# EAGLE board motordriver_4ch (EAGLE 6.5.0)
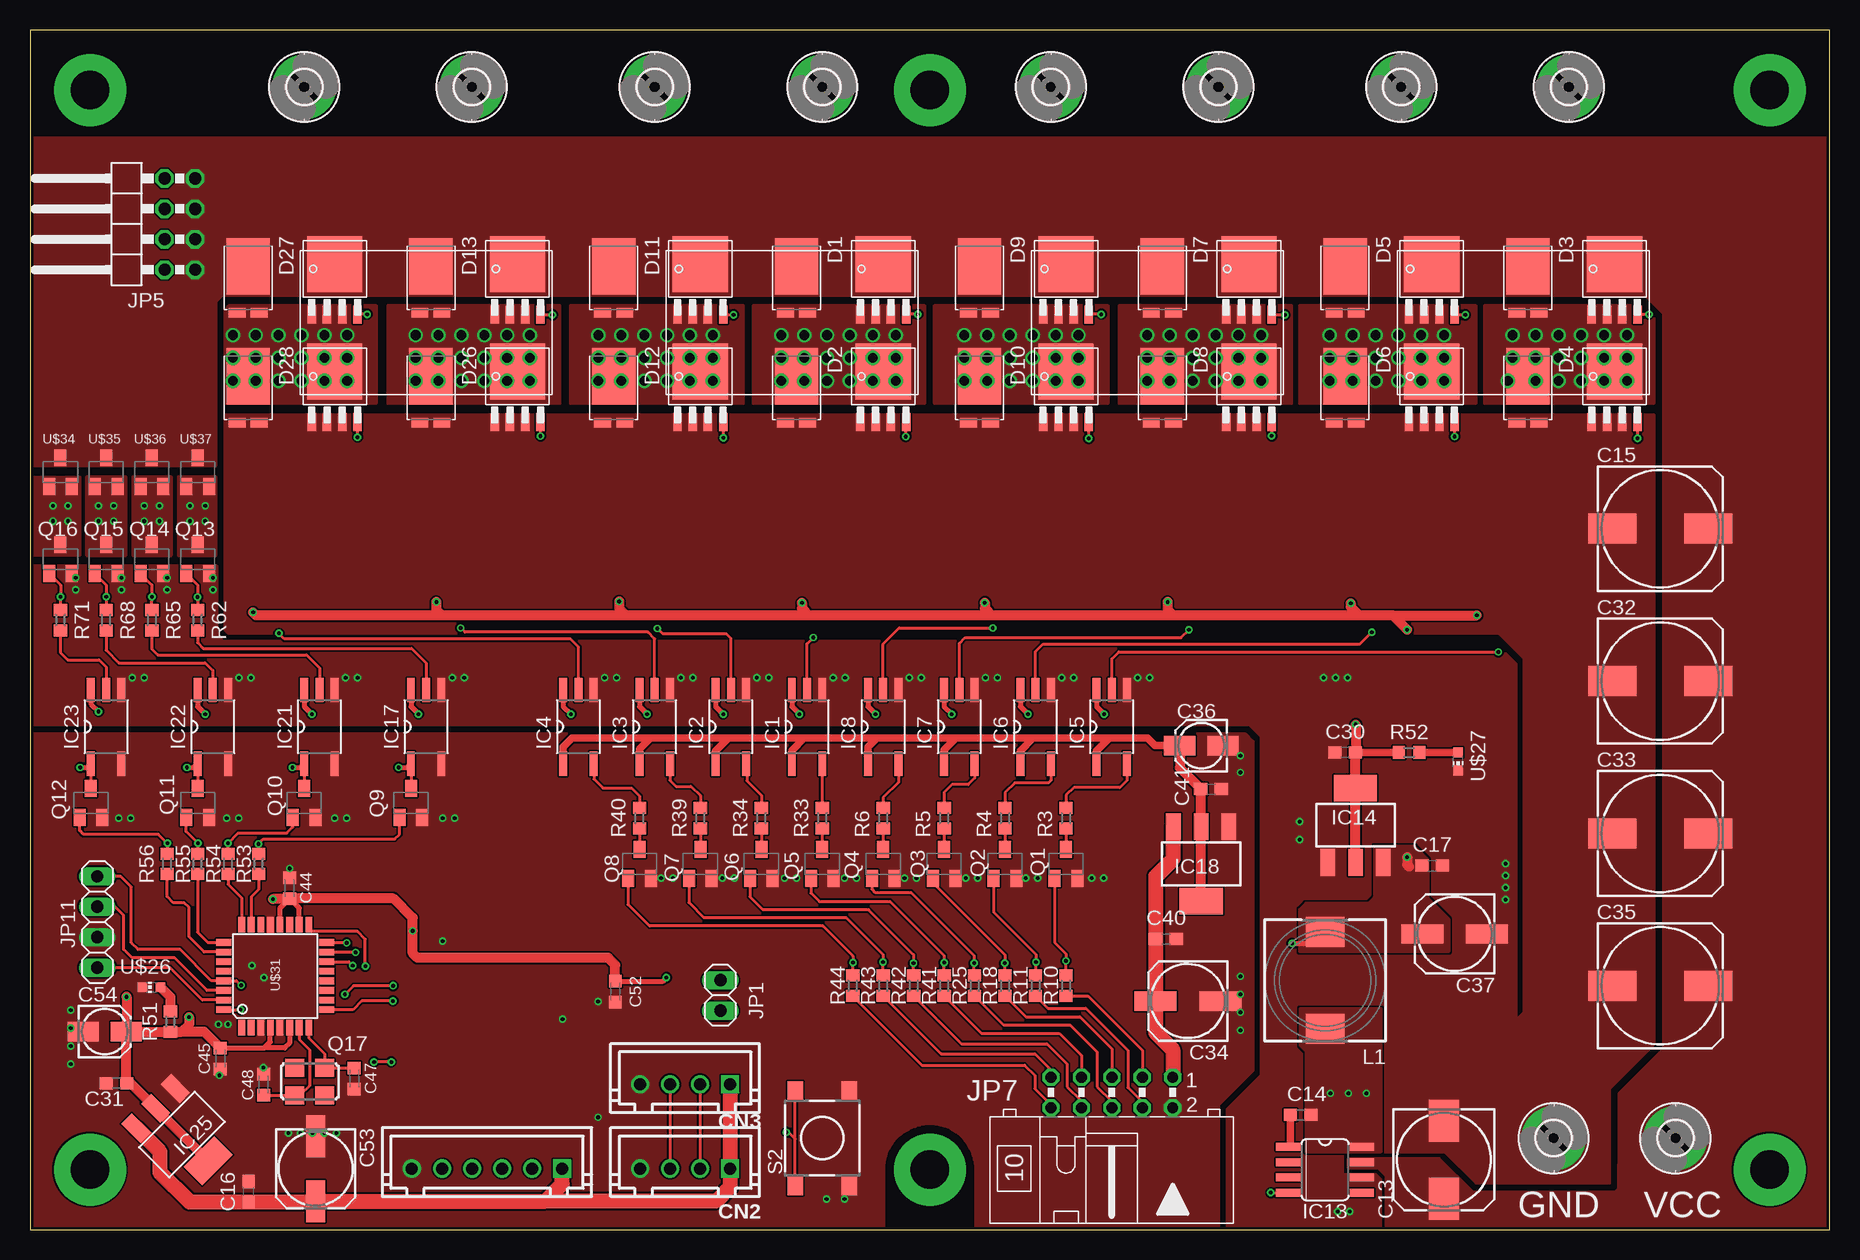
[diagram p1: board, top side]
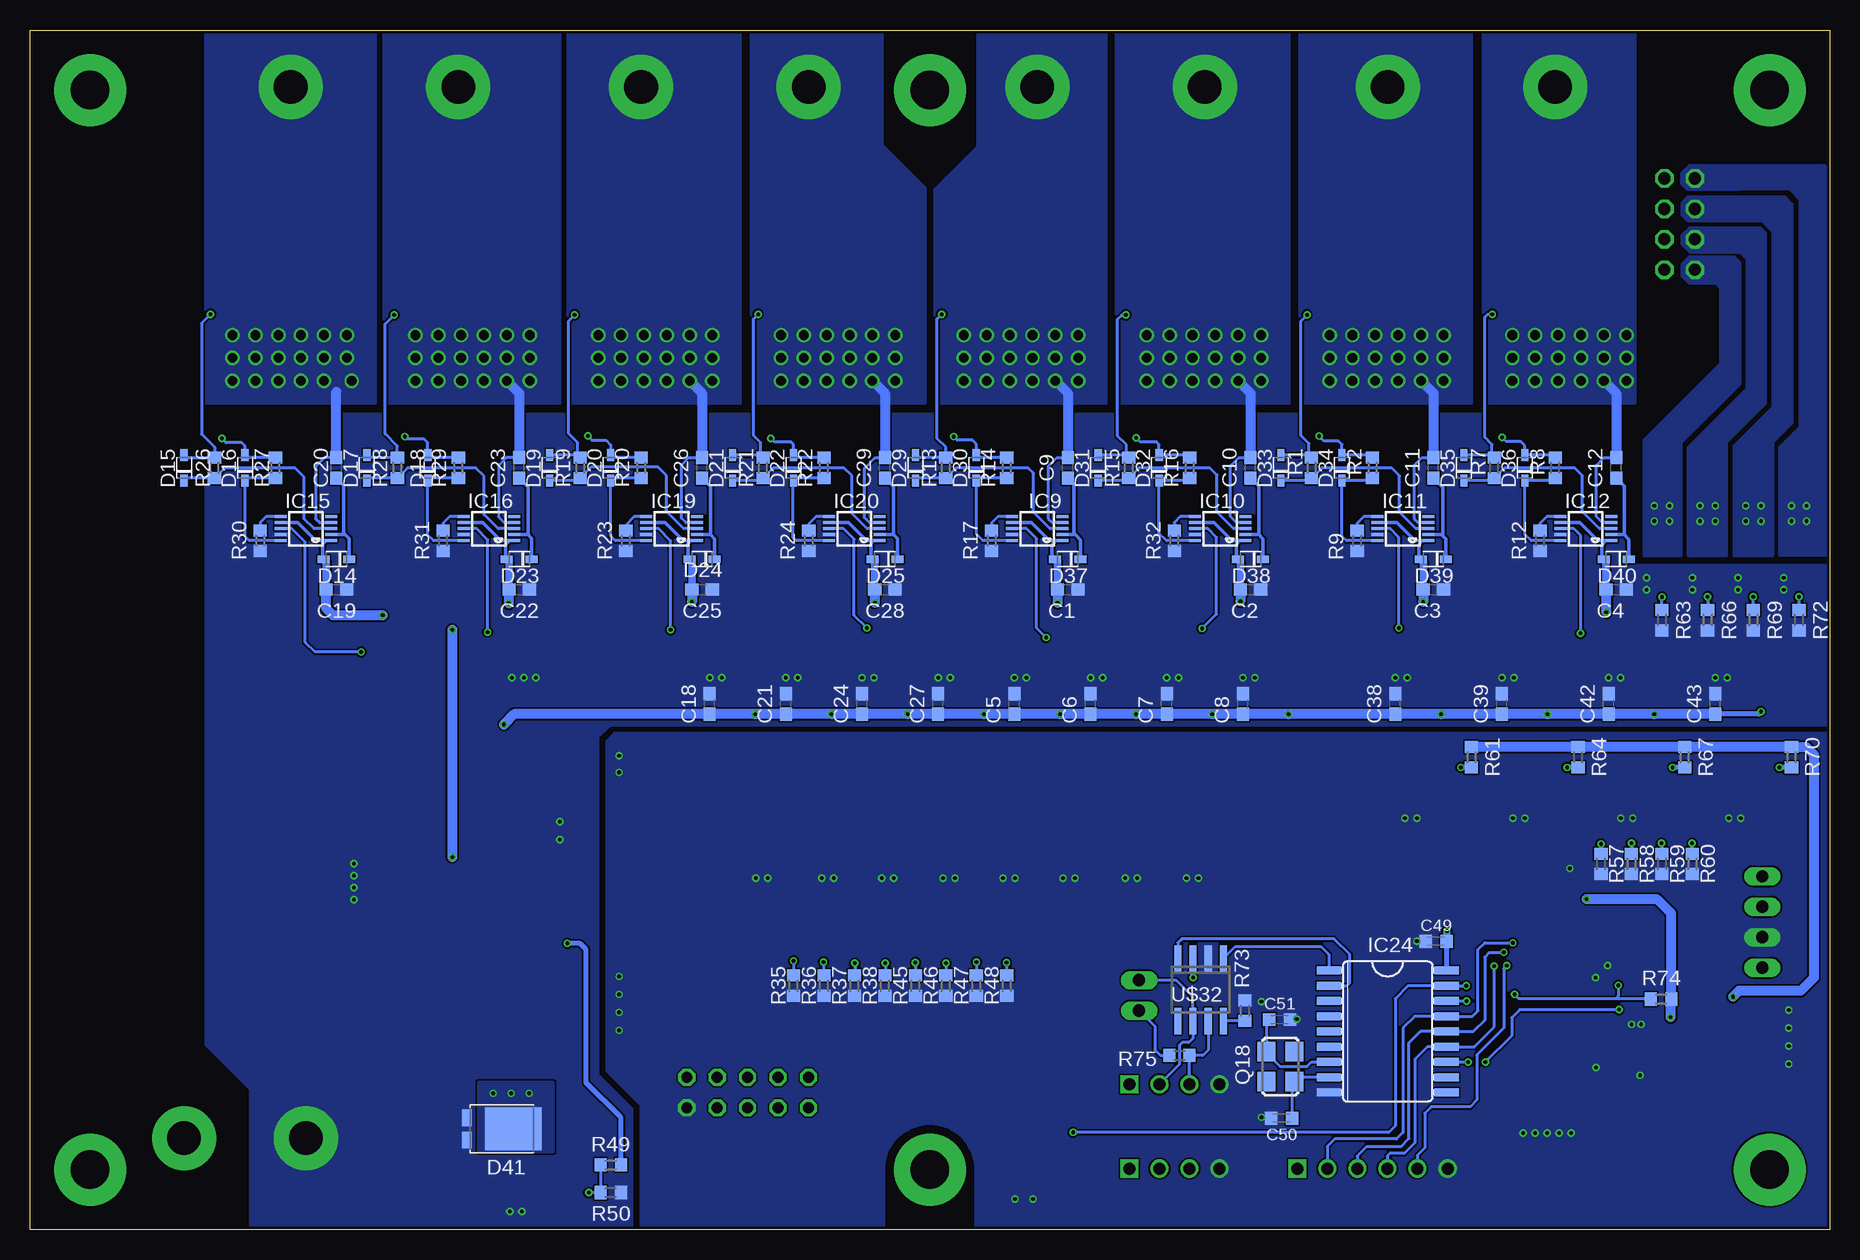
[diagram p2: board, bottom side, seen from below]

Size 150 x 100 mm. Coordinates in mm from the lower left corner, seen from the top.
Outline: 0,0 150,0 150,100 0,100 0,0
Copper layers (1*16): Top 0.035mm / dielectric 1.5mm / Bottom 0.035mm
Design rules "Elecrow_2-layer_eagle_rule": minimum track width 6mil, minimum drill 12mil, track to track 6mil, track to pad 6mil, pad to pad 6mil, via to via 6mil, smd to smd 0mil, copper to edge 10mil, drill to drill 10mil, minimum pad ring 10mil, minimum via ring 6mil, stop-mask expansion 2mil, vias tented up to drill 100mil, thermal gap 10mil
tRestrict: 14 lines
bRestrict: 14 lines

## Footprints (pad centres in the part's own frame; a part is rotated, then mirrored left to right if it is on the bottom)
C0603 = smd 1.1 x 1: 1 -0.85,0; 2 0.85,0
153CLV-0810 = smd 3.5 x 2.5: + 3.25,0; - -3.25,0
153CLV-1010 = smd 4 x 2.5: + 4,0; - -4,0
153CLV-0605 = smd 3.5 x 1.6: + 2.7,0; - -2.7,0
153CLV-0405 = smd 2.6 x 1.6: + 1.8,0; - -1.8,0
C0603K = smd 1.05 x 1.08: 1 -0.875,0; 2 0.875,0
JST-B4B-XH-A = drill 1 square: 1 -3.75,0 | drill 1: 2 -1.25,0; 3 1.25,0; 4 3.75,0
POWER_DI_5 = smd 0.8 x 1.4: A1 3.87,0.92; A2 3.87,-0.92 | smd 4.7 x 3.6: K 0,0
USC(1.25X2.5) = smd 1 x 0.6: A -1.05,0; K 1.05,0
MFSOP6 = smd 0.66 x 2.032: 1 -1.27,-3.073; 3 1.27,-3.073; 4 1.27,3.073; 5 0,3.073; 6 -1.27,3.073
MSOP10 = smd 0.25 x 1: 1 -1,-2.113; 2 -0.5,-2.113; 3 0,-2.113; 4 0.5,-2.113; 5 1,-2.113; 6 1,2.113; 7 0.5,2.113; 8 0,2.113; 9 -0.5,2.113; 10 -1,2.113
SOP8-150 = smd 0.66 x 2.032: 1 -1.27,-3.073; 2 0,-3.073; 3 1.27,-3.073; 4 2.54,-3.073; 5 2.54,3.073; 6 1.27,3.073; 7 0,3.073; 8 -1.27,3.073
SOT223 = smd 1.219 x 2.235: 1 -2.311,-3.099; 2 0,-3.099; 3 2.311,-3.099 | smd 3.6 x 2.2: 4 0,3.099
SO18L = smd 0.66 x 2.032: 1 -5.08,-4.902; 2 -3.81,-4.902; 3 -2.54,-4.902; 4 -1.27,-4.902; 5 0,-4.902; 6 1.27,-4.902; 7 2.54,-4.902; 8 3.81,-4.902; 9 5.08,-4.902; 10 5.08,4.902; 11 3.81,4.902; 12 2.54,4.902; 13 1.27,4.902; 14 0,4.902; 15 -1.27,4.902; 16 -2.54,4.902; 17 -3.81,4.902; 18 -5.08,4.902
1X02 = drill 1.016 long: 1 -1.27,0; 2 1.27,0
2X04/90 = drill 1.016 octagon: 1 -3.81,-6.35; 2 -3.81,-3.81; 3 -1.27,-6.35; 4 -1.27,-3.81; 5 1.27,-6.35; 6 1.27,-3.81; 7 3.81,-6.35; 8 3.81,-3.81
ML10L = drill 0.914 octagon: 1 -5.08,-1.27; 2 -5.08,1.27; 3 -2.54,-1.27; 4 -2.54,1.27; 5 0,-1.27; 6 0,1.27; 7 2.54,-1.27; 8 2.54,1.27; 9 5.08,-1.27; 10 5.08,1.27
1X04 = drill 1.016 long: 1 -3.81,0; 2 -1.27,0; 3 1.27,0; 4 3.81,0
SLF10145 = smd 3.2 x 2.5: P$1 0,4.05; P$2 0,-4.05
SC-59(TYPE1) = smd 1 x 1.4: B -0.95,-1.2; C 0,1.2; E 0.95,-1.2
ASF = smd 1.6 x 1.5: 1 -1.25,-1.15; 2 1.25,-1.15; 3 1.25,1.15; 4 -1.25,1.15
R0603 = smd 1 x 1.1: 1 -0.85,0; 2 0.85,0
DTSM-6 = smd 1.55 x 1.3: 1 -3.975,2.25; 2 3.975,2.25; 3 -3.975,-2.25; 4 3.975,-2.25
2,8-PAD = drill 2.8 pad 5.334: B2,8 0,0
LFPAK56 = smd 0.7 x 1.5: 1 -1.905,-3.8; 2 -0.635,-3.8; 3 0.635,-3.8; 4 1.905,-3.8 | smd 4.6 x 4.7: 5 0,0.4
0603 = smd 0.8 x 0.8: A 0,-0.75; C 0,0.75
JST-B6B-XH-A = drill 1 square: 1 0.08,0 | drill 1: 2 2.58,0; 3 5.08,0; 4 7.58,0; 5 10.08,0; 6 12.62,0
TQFP = smd 1.27 x 0.559: 1 -4.293,2.8; 2 -4.293,2; 3 -4.293,1.2; 4 -4.293,0.4; 5 -4.293,-0.4; 6 -4.293,-1.2; 7 -4.293,-2; 8 -4.293,-2.8; 17 4.293,-2.8; 18 4.293,-2; 19 4.293,-1.2; 20 4.293,-0.4; 21 4.293,0.4; 22 4.293,1.2; 23 4.293,2; 24 4.293,2.8 | smd 0.559 x 1.27: 9 -2.8,-4.293; 10 -2,-4.293; 11 -1.2,-4.293; 12 -0.4,-4.293; 13 0.4,-4.293; 14 1.2,-4.293; 15 2,-4.293; 16 2.8,-4.293; 25 2.8,4.293; 26 2,4.293; 27 1.2,4.293; 28 0.4,4.293; 29 -0.4,4.293; 30 -1.2,4.293; 31 -2,4.293; 32 -2.8,4.293
SOIC = smd 0.6 x 2.2: 1 -1.905,-2.6; 2 -0.635,-2.6; 3 0.635,-2.6; 4 1.905,-2.6; 5 1.905,2.6; 6 0.635,2.6; 7 -0.635,2.6; 8 -1.905,2.6
SC-59 = smd 1 x 1.4: A@1 -0.95,-1.2; A@2 0.95,-1.2; K 0,1.2

## Placement (x,y rotation side)
C1  50V,0.1u  [C0603]  63.5,53.34 0 bottom
C2  50V,0.1u  [C0603]  48.26,53.34 0 bottom
C3  50V,0.1u  [C0603]  33.02,53.34 0 bottom
C4  50V,0.1u  [C0603]  17.78,53.34 0 bottom
C5  50V,0.1u  [C0603]  67.94,43.81 90 bottom
C6  50V,0.1u  [C0603]  61.59,43.81 90 bottom
C7  50V,0.1u  [C0603]  55.24,43.81 90 bottom
C8  50V,0.1u  [C0603]  48.9,43.81 90 bottom
C9  50v,1u  [C0603]  63.5,63.5 90 bottom
C10  50v,1u  [C0603]  48.26,63.5 90 bottom
C11  50v,1u  [C0603]  33.02,63.5 90 bottom
C12  50v,1u  [C0603]  17.78,63.5 90 bottom
C13  35v,220u  [153CLV-0810]  117.86,5.82 270 top
C14  0.01u,50v  [C0603]  105.91,9.55 0 top
C15  35v,330u  [153CLV-1010]  135.89,58.42 0 top
C16  50V,0.1u  [C0603]  18.24,3.15 90 top
C17  50V,0.1u  [C0603]  116.88,30.34 0 top
C18  50V,0.1u  [C0603]  93.34,43.81 90 bottom
C19  50V,0.1u  [C0603]  124.46,53.34 0 bottom
C20  50v,1u  [C0603]  124.46,63.5 90 bottom
C21  50V,0.1u  [C0603]  87,43.81 90 bottom
C22  50V,0.1u  [C0603]  109.22,53.34 0 bottom
C23  50v,1u  [C0603]  109.22,63.5 90 bottom
C24  50V,0.1u  [C0603]  80.64,43.81 90 bottom
C25  50V,0.1u  [C0603]  93.98,53.34 0 bottom
C26  50v,1u  [C0603]  93.98,63.5 90 bottom
C27  50V,0.1u  [C0603]  74.3,43.81 90 bottom
C28  50V,0.1u  [C0603]  78.74,53.34 0 bottom
C29  50v,1u  [C0603]  78.74,63.5 90 bottom
C30  50V,0.1u  [C0603]  109.63,39.78 180 top
C31  50V,0.1u  [C0603]  7.2,12.19 180 top
C32  35v,330u  [153CLV-1010]  135.89,45.72 0 top
C33  35v,330u  [153CLV-1010]  135.89,33.02 0 top
C34  16v,100u  [153CLV-0605]  96.52,19.05 180 top
C35  35v,330u  [153CLV-1010]  135.89,20.32 0 top
C36  47uF  [153CLV-0405]  97.64,40.34 180 top
C37  16v,100u  [153CLV-0605]  118.75,24.65 180 top
C38  0.1u  [C0603]  36.2,43.81 90 bottom
C39  0.1u  [C0603]  27.3,43.81 90 bottom
C40  50V,0.1u  [C0603]  94.69,24.23 0 top
C41  50V,0.1u  [C0603]  98.44,36.73 0 top
C42  0.1u  [C0603]  18.41,43.81 90 bottom
C43  0.1u  [C0603]  9.53,43.81 90 bottom
C44  0.1u  [C0603K]  21.64,28.47 90 top
C45  0.1u  [C0603K]  15.86,14.26 270 top
C47  22p  [C0603K]  27.03,12.59 90 top
C48  22p  [C0603K]  19.47,12.07 270 top
C49  0.1u  [C0603K]  32.79,24.03 180 bottom
C50  10p  [C0603K]  45.67,9.28 0 bottom
C51  10p  [C0603K]  45.82,17.5 180 bottom
C52  0.1u  [C0603K]  48.79,19.83 270 top
C53  16v,100u  [153CLV-0605]  23.81,5.07 270 top
C54  47uF  [153CLV-0405]  6.23,16.5 0 top
CN2  CN4-JST-XH-TOP  [JST-B4B-XH-A]  54.61,5.08 180 top
CN3  CN4-JST-XH-TOP  [JST-B4B-XH-A]  54.61,12.1 180 top
D1  PDS540  [POWER_DI_5]  63.9,80.28 270 top
D2  PDS540  [POWER_DI_5]  63.9,71.12 270 top
D3  PDS540  [POWER_DI_5]  124.86,80.28 270 top
D4  PDS540  [POWER_DI_5]  124.86,71.12 270 top
D5  PDS540  [POWER_DI_5]  109.62,80.28 270 top
D6  PDS540  [POWER_DI_5]  109.62,71.12 270 top
D7  PDS540  [POWER_DI_5]  94.38,80.28 270 top
D8  PDS540  [POWER_DI_5]  94.38,71.12 270 top
D9  PDS540  [POWER_DI_5]  79.14,80.28 270 top
D10  PDS540  [POWER_DI_5]  79.14,71.12 270 top
D11  PDS540  [POWER_DI_5]  48.66,80.28 270 top
D12  PDS540  [POWER_DI_5]  48.66,71.12 270 top
D13  PDS540  [POWER_DI_5]  33.42,80.28 270 top
D14  1SS404  [USC(1.25X2.5)]  124.46,55.88 0 bottom
D15  1SS404  [USC(1.25X2.5)]  137.16,63.5 270 bottom
D16  1SS404  [USC(1.25X2.5)]  132.08,63.5 270 bottom
D17  1SS404  [USC(1.25X2.5)]  121.92,63.5 270 bottom
D18  1SS404  [USC(1.25X2.5)]  116.84,63.5 270 bottom
D19  1SS404  [USC(1.25X2.5)]  106.68,63.5 270 bottom
D20  1SS404  [USC(1.25X2.5)]  101.6,63.5 270 bottom
D21  1SS404  [USC(1.25X2.5)]  91.44,63.5 270 bottom
D22  1SS404  [USC(1.25X2.5)]  86.36,63.5 270 bottom
D23  1SS404  [USC(1.25X2.5)]  109.22,55.88 0 bottom
D24  1SS404  [USC(1.25X2.5)]  93.98,55.88 0 bottom
D25  1SS404  [USC(1.25X2.5)]  78.74,55.88 0 bottom
D26  PDS540  [POWER_DI_5]  33.42,71.12 270 top
D27  PDS540  [POWER_DI_5]  18.18,80.28 270 top
D28  PDS540  [POWER_DI_5]  18.18,71.12 270 top
D29  1SS404  [USC(1.25X2.5)]  76.2,63.5 270 bottom
D30  1SS404  [USC(1.25X2.5)]  71.12,63.5 270 bottom
D31  1SS404  [USC(1.25X2.5)]  60.96,63.5 270 bottom
D32  1SS404  [USC(1.25X2.5)]  55.88,63.5 270 bottom
D33  1SS404  [USC(1.25X2.5)]  45.72,63.5 270 bottom
D34  1SS404  [USC(1.25X2.5)]  40.64,63.5 270 bottom
D35  1SS404  [USC(1.25X2.5)]  30.48,63.5 270 bottom
D36  1SS404  [USC(1.25X2.5)]  25.4,63.5 270 bottom
D37  1SS404  [USC(1.25X2.5)]  63.5,55.88 0 bottom
D38  1SS404  [USC(1.25X2.5)]  48.26,55.88 0 bottom
D39  1SS404  [USC(1.25X2.5)]  33.02,55.88 0 bottom
D40  1SS404  [USC(1.25X2.5)]  17.78,55.88 0 bottom
D41  PDS540  [POWER_DI_5]  109.72,8.38 180 bottom
IC1  TLP117  [MFSOP6]  64.77,41.91 0 top
IC2  TLP117  [MFSOP6]  58.42,41.91 0 top
IC3  TLP117  [MFSOP6]  52.07,41.91 0 top
IC4  TLP117  [MFSOP6]  45.72,41.91 0 top
IC5  TLP117  [MFSOP6]  90.17,41.91 0 top
IC6  TLP117  [MFSOP6]  83.82,41.91 0 top
IC7  TLP117  [MFSOP6]  77.47,41.91 0 top
IC8  TLP117  [MFSOP6]  71.12,41.91 0 top
IC9  LM5106  [MSOP10]  66.04,58.42 90 bottom
IC10  LM5106  [MSOP10]  50.8,58.42 90 bottom
IC11  LM5106  [MSOP10]  35.56,58.42 90 bottom
IC12  LM5106  [MSOP10]  20.32,58.42 90 bottom
IC13  LM2675-ADJ  [SOP8-150]  107.95,5.62 270 top
IC14  LM1117MPX-5.0  [SOT223]  110.49,33.7 0 top
IC15  LM5106  [MSOP10]  127,58.42 90 bottom
IC16  LM5106  [MSOP10]  111.76,58.42 90 bottom
IC17  TLP117  [MFSOP6]  33.02,41.91 0 top
IC18  LM1117MPX-5.0  [SOT223]  97.62,30.48 180 top
IC19  LM5106  [MSOP10]  96.52,58.42 90 bottom
IC20  LM5106  [MSOP10]  81.28,58.42 90 bottom
IC21  TLP117  [MFSOP6]  24.13,41.91 0 top
IC22  TLP117  [MFSOP6]  15.24,41.91 0 top
IC23  TLP117  [MFSOP6]  6.35,41.91 0 top
IC24  MCP2515-E/SO  [SO18L]  36.83,16.51 270 bottom
IC25  LM1117MPX-5.0  [SOT223]  12.67,7.91 225 top
JP1  [1X02]  57.55,19.52 270 top
JP5  [2X04/90]  7.41,83.82 90 top
JP7  MOTOR  [ML10L]  90.17,11.43 180 top
JP11  [1X04]  5.61,25.64 90 top
L1  68u,1.2A  [SLF10145]  107.95,20.77 180 top
Q1  2SC2712  [SC-59(TYPE1)]  86.36,30.48 0 top
Q2  2SC2712  [SC-59(TYPE1)]  81.28,30.48 0 top
Q3  2SC2712  [SC-59(TYPE1)]  76.2,30.48 0 top
Q4  2SC2712  [SC-59(TYPE1)]  71.12,30.48 0 top
Q5  2SC2712  [SC-59(TYPE1)]  66.04,30.48 0 top
Q6  2SC2712  [SC-59(TYPE1)]  60.96,30.48 0 top
Q7  2SC2712  [SC-59(TYPE1)]  55.88,30.48 0 top
Q8  2SC2712  [SC-59(TYPE1)]  50.8,30.48 0 top
Q9  2SC2712  [SC-59(TYPE1)]  31.75,35.56 0 top
Q10  2SC2712  [SC-59(TYPE1)]  22.86,35.56 0 top
Q11  2SC2712  [SC-59(TYPE1)]  13.97,35.56 0 top
Q12  2SC2712  [SC-59(TYPE1)]  5.08,35.56 0 top
Q13  2SC2712  [SC-59(TYPE1)]  13.97,55.88 0 top
Q14  2SC2712  [SC-59(TYPE1)]  10.16,55.88 0 top
Q15  2SC2712  [SC-59(TYPE1)]  6.35,55.88 0 top
Q16  2SC2712  [SC-59(TYPE1)]  2.54,55.88 0 top
Q17  ASF1  [ASF]  23.32,12.34 0 top
Q18  ASF1  [ASF]  45.77,13.59 90 bottom
R1  47  [R0603]  43.18,63.5 90 bottom
R2  47  [R0603]  38.1,63.5 90 bottom
R3  300  [R0603]  86.36,34.29 90 top
R4  300  [R0603]  81.28,34.29 90 top
R5  300  [R0603]  76.2,34.29 90 top
R6  300  [R0603]  71.12,34.29 90 top
R7  47  [R0603]  27.94,63.5 90 bottom
R8  47  [R0603]  22.86,63.5 90 bottom
R9  51k  [R0603]  39.37,57.42 90 bottom
R10  10k  [R0603]  86.36,20.32 90 top
R11  10k  [R0603]  83.82,20.32 90 top
R12  51k  [R0603]  24.13,57.42 90 bottom
R13  47  [R0603]  73.66,63.5 90 bottom
R14  47  [R0603]  68.58,63.5 90 bottom
R15  47  [R0603]  58.42,63.5 90 bottom
R16  47  [R0603]  53.34,63.5 90 bottom
R17  51k  [R0603]  69.85,57.42 90 bottom
R18  10k  [R0603]  81.28,20.32 90 top
R19  47  [R0603]  104.14,63.5 90 bottom
R20  47  [R0603]  99.06,63.5 90 bottom
R21  47  [R0603]  88.9,63.5 90 bottom
R22  47  [R0603]  83.82,63.5 90 bottom
R23  51k  [R0603]  100.33,57.42 90 bottom
R24  51k  [R0603]  85.09,57.42 90 bottom
R25  10k  [R0603]  78.74,20.32 90 top
R26  47  [R0603]  134.62,63.5 90 bottom
R27  47  [R0603]  129.54,63.5 90 bottom
R28  47  [R0603]  119.38,63.5 90 bottom
R29  47  [R0603]  114.3,63.5 90 bottom
R30  51k  [R0603]  130.81,57.42 90 bottom
R31  51k  [R0603]  115.57,57.42 90 bottom
R32  51k  [R0603]  54.61,57.42 90 bottom
R33  300  [R0603]  66.04,34.29 90 top
R34  300  [R0603]  60.96,34.29 90 top
R35  10k  [R0603]  86.36,20.32 90 bottom
R36  10k  [R0603]  83.82,20.32 90 bottom
R37  10k  [R0603]  81.28,20.32 90 bottom
R38  10k  [R0603]  78.74,20.32 90 bottom
R39  300  [R0603]  55.88,34.29 90 top
R40  300  [R0603]  50.8,34.29 90 top
R41  10k  [R0603]  76.2,20.32 90 top
R42  10k  [R0603]  73.66,20.32 90 top
R43  10k  [R0603]  71.12,20.32 90 top
R44  10k  [R0603]  68.58,20.32 90 top
R45  10k  [R0603]  76.2,20.32 90 bottom
R46  10k  [R0603]  73.66,20.32 90 bottom
R47  10k  [R0603]  71.12,20.32 90 bottom
R48  10k  [R0603]  68.58,20.32 90 bottom
R49  10k  [R0603]  101.6,5.39 180 bottom
R50  1.5k  [R0603]  101.6,3.08 0 bottom
R51  1k  [R0603]  11.7,17.33 270 top
R52  1k  [R0603]  114.96,39.77 180 top
R53  10k  [R0603]  19.05,30.48 270 top
R54  10k  [R0603]  16.51,30.48 270 top
R55  10k  [R0603]  13.97,30.48 270 top
R56  10k  [R0603]  11.43,30.48 270 top
R57  10k  [R0603]  19.05,30.48 270 bottom
R58  10k  [R0603]  16.51,30.48 270 bottom
R59  10k  [R0603]  13.97,30.48 270 bottom
R60  10k  [R0603]  11.43,30.48 270 bottom
R61  300  [R0603]  29.84,39.37 90 bottom
R62  1k  [R0603]  13.97,50.8 270 top
R63  10k  [R0603]  13.97,50.8 270 bottom
R64  300  [R0603]  20.95,39.37 90 bottom
R65  1k  [R0603]  10.16,50.8 270 top
R66  10k  [R0603]  10.16,50.8 270 bottom
R67  300  [R0603]  12.06,39.37 90 bottom
R68  1k  [R0603]  6.35,50.8 270 top
R69  10k  [R0603]  6.35,50.8 270 bottom
R70  300  [R0603]  3.17,39.37 90 bottom
R71  1k  [R0603]  2.54,50.8 270 top
R72  10k  [R0603]  2.54,50.8 270 bottom
R73  10k  [R0603]  48.73,18.25 90 bottom
R74  10k  [R0603]  14.04,19.21 0 bottom
R75  120  [R0603]  54.19,14.51 180 bottom
S2  DTSM-6  [DTSM-6]  66.04,7.62 90 top
U$1  MOUNT-PAD-ROUND2.8  [2,8-PAD]  66.04,95.25 0 top
U$2  MOUNT-PAD-ROUND2.8  [2,8-PAD]  52.07,95.25 0 top
U$3  MOUNT-PAD-ROUND2.8  [2,8-PAD]  36.83,95.25 0 top
U$4  MOUNT-PAD-ROUND2.8  [2,8-PAD]  22.86,95.25 0 top
U$5  PSMN1R0-40YLD  [LFPAK56]  25.4,71.12 0 top
U$6  PSMN1R0-40YLD  [LFPAK56]  71.12,80.08 0 top
U$7  PSMN1R0-40YLD  [LFPAK56]  71.12,71.12 0 top
U$8  PSMN1R0-40YLD  [LFPAK56]  86.36,71.12 0 top
U$9  PSMN1R0-40YLD  [LFPAK56]  55.88,80.08 0 top
U$10  PSMN1R0-40YLD  [LFPAK56]  55.88,71.12 0 top
U$11  PSMN1R0-40YLD  [LFPAK56]  40.64,80.08 0 top
U$12  PSMN1R0-40YLD  [LFPAK56]  40.64,71.12 0 top
U$13  MOUNT-PAD-ROUND2.8  [2,8-PAD]  128.27,95.25 0 top
U$14  MOUNT-PAD-ROUND2.8  [2,8-PAD]  114.3,95.25 0 top
U$15  MOUNT-PAD-ROUND2.8  [2,8-PAD]  99.06,95.25 0 top
U$16  MOUNT-PAD-ROUND2.8  [2,8-PAD]  85.09,95.25 0 top
U$17  PSMN1R0-40YLD  [LFPAK56]  25.4,80.08 0 top
U$18  HS-12216  [HS-12216]  93.98,75.6 0 top
U$19  PSMN1R0-40YLD  [LFPAK56]  132.08,80.08 0 top
U$20  PSMN1R0-40YLD  [LFPAK56]  132.08,71.12 0 top
U$21  PSMN1R0-40YLD  [LFPAK56]  116.84,80.08 0 top
U$22  PSMN1R0-40YLD  [LFPAK56]  116.84,71.12 0 top
U$23  PSMN1R0-40YLD  [LFPAK56]  101.6,80.08 0 top
U$24  PSMN1R0-40YLD  [LFPAK56]  101.6,71.12 0 top
U$25  PSMN1R0-40YLD  [LFPAK56]  86.36,80.08 0 top
U$26  0603  [0603]  10.14,20.2 90 top
U$27  0603  [0603]  119.04,39.02 180 top
U$28  MOUNT-PAD-ROUND2.8  [2,8-PAD]  137.16,7.62 0 top
U$29  MOUNT-PAD-ROUND2.8  [2,8-PAD]  127,7.62 0 top
U$30  CN6  [JST-B6B-XH-A]  44.45,5.08 180 top
U$31  ATMEGA328P  [TQFP]  20.44,21.13 90 top
U$32  MCP2551  [SOIC]  52.42,19.99 180 bottom
U$33  HS-12216  [HS-12216]  124.46,75.6 0 top
U$34  DAN202K  [SC-59]  2.54,63.14 0 top
U$35  DAN202K  [SC-59]  6.35,63.14 0 top
U$36  DAN202K  [SC-59]  10.16,63.14 0 top
U$37  DAN202K  [SC-59]  13.97,63.14 0 top
U$38  HS-12216  [HS-12216]  63.5,75.6 0 top
U$39  HS-12216  [HS-12216]  33.02,75.6 0 top

## Tracks (layer width: path | path; a pad name or v marks a point on that pad's centre or on a via)
3V3/2  (via drill 0.31)
  Top 0.406: IC23.6 5.08,43.81 v5.71,43.18 | IC22.6 13.97,43.6 v14.61,42.97 | IC21.6 22.86,43.6 v23.5,42.97 | IC17.6 31.75,43.6 v32.38,42.97 | IC4.6 44.45,43.6 v45.09,42.97 | IC3.6 50.8,43.6 v51.44,42.97 | IC2.6 57.15,43.6 v57.78,42.97 | IC1.6 63.5,43.6 v64.14,42.97 | IC8.6 69.85,43.6 v70.48,42.97 | IC7.6 76.2,43.6 v76.83,42.97 | IC6.6 82.55,43.6 v83.19,42.97 | IC5.6 88.9,43.6 v89.53,42.97
  Top 0.61: C30.1 114.09,39.78 R52.2
  Top 0.813: IC14.2 IC14.4 | IC14.4 110.49,36.89 110.8,37.2 110.8,37.1 IC14.4 | IC14.4 C30.1 110.5,39.8 v110.5,42.1
  Bottom 0.406: v5.71,43.18 5.93,42.97 C43.1
  Bottom 0.813: C43.1 v14.61,42.97 C42.1 v23.5,42.97 C39.1 v32.38,42.97 C38.1 v45.09,42.97 C8.1 v51.44,42.97 C7.1 v57.78,42.97 C6.1 v64.14,42.97 C5.1 v70.48,42.97 C27.1 v76.83,42.97 C24.1 v83.19,42.97 C21.1 v89.53,42.97 C18.1 109.64,42.97 v110.5,42.1
+3V3
  Top 0.61: IC4.1 44.45,40.25 45.17,40.97 51.72,40.97 | 51.72,40.97 58.22,40.97 | 58.22,40.97 64.54,40.97 | 64.54,40.97 70.61,40.97 | 70.61,40.97 77.19,40.97 | 77.19,40.97 83.62,40.97 | 83.62,40.97 89.97,40.97 | 89.97,40.97 93.16,40.97 93.79,40.34 C36.+ | IC3.1 50.8,40.05 51.72,40.97 | IC2.1 57.15,39.9 58.22,40.97 | IC1.1 63.5,39.93 64.54,40.97 | IC8.1 69.85,40.21 70.61,40.97 | IC7.1 76.2,39.98 77.19,40.97 | IC6.1 82.55,39.9 83.62,40.97 | IC5.1 88.9,39.9 89.97,40.97
  Top 0.813: IC18.4 IC18.2 97.59,33.61 C41.1 95.84,38.48 C36.+
+5V  (via drill 0.31)
  Top 0.406: C45.1 19.54,15.13 | 19.54,15.13 20.04,15.64 U$31.4 | U$31.18 22.44,26.8 C44.1 20.84,26.8 U$31.20 | C52.1 52.76,20.7 v53.05,21 | U$31.6 21.64,15.54 21.23,15.13 19.54,15.13
  Top 0.61: C44.1 21.59,27.55 | 31.93,24.87 v31.9,24.9
  Top 0.813: IC25.4 IC25.2 8.39,12.19 C31.1 8.03,12.21 C54.+ | C54.+ 8.05,16.48 R51.2 12.65,16.48 | 21.59,27.55 v20.25,27.55 | v13.25,17.7 13.25,17.08 12.65,16.48 | C45.1 14.52,16.48 12.65,16.48 | C44.1 30.3,27.59 31.9,26 v31.9,24.9 31.9,23.03 32.28,22.65 48.2,22.65 48.79,22.06 C52.1 | v8.05,19.4 8.05,16.52 C54.+
  Bottom 0.406: v53.05,21 U$32.3 | C49.1 31.93,24.02 IC24.18
  Bottom 0.61: 13.25,19.15 R74.2 | C49.1 31.9,24.05 v31.9,24.9
  Bottom 0.813: v20.25,27.55 14.4,27.55 13.19,26.34 R74.2 | v13.25,17.7 13.25,19.15 | R61.2 R64.2 R67.2 R70.2 1.92,40.22 1.3,39.6 1.3,21 2.4,19.9 7.55,19.9 v8.05,19.4
+7V
  Top 0.813: C34.+ 93.84,19.07
  Top 1.27: C34.+ 93.82,16.43 95.25,15 JP7.1 | 93.84,19.07 C40.1 93.84,29.44 95.31,30.91 IC18.3
+9V  (via drill 0.31)
  Top 0.406: v105.2,23.85 106.2,23.85
  Top 0.813: 113.6,51.2 110.8,51.2 | 110.8,51.2 95.3,51.2 | 95.3,51.2 80.2,51.2 | 80.2,51.2 64.95,51.2 | 64.95,51.2 49.7,51.2 | 49.7,51.2 34.35,51.2 | 34.35,51.2 18.85,51.2 v18.6,51.45 | v33.87,52.32 33.87,51.68 34.35,51.2 | v64.35,52.25 64.35,51.8 64.95,51.2 | v94.83,52.32 94.83,51.67 95.3,51.2 | 113.6,51.2 v114.8,50 | v114.8,31.05 114.8,30.4 114.95,30.25 | 113.6,51.2 v120.6,51.2 | v49.11,52.36 49.11,51.79 49.7,51.2 | v79.59,52.26 79.59,51.81 80.2,51.2 | v110.1,52.2 110.1,51.9 110.8,51.2
  Bottom 0.305: D14.A 125.6,55.97 125.6,57.15 125.33,57.42 IC15.1 126.17,57.42 127.67,58.92 IC15.7 | D23.A 110.35,55.96 110.35,57.1 110.03,57.42 IC16.1 110.77,57.42 112.27,58.92 IC16.7 | D24.A 95.15,56 95.15,57.2 94.93,57.42 IC19.1 95.57,57.42 97.07,58.92 IC19.7 | D25.A 79.9,55.99 79.9,57.2 79.68,57.42 IC20.1 80.27,57.42 81.77,58.92 IC20.7 | IC9.1 64.48,57.42 | 64.48,57.42 64.8,57.1 64.8,56.13 D37.A | IC9.7 66.52,58.92 65.02,57.42 64.48,57.42 | IC10.7 51.32,58.92 49.82,57.42 IC10.1 49.18,57.42 49.45,57.15 49.45,56.02 D38.A | IC11.7 36.07,58.92 34.57,57.42 IC11.1 33.93,57.42 34.25,57.1 34.25,56.06 D39.A | IC12.7 20.82,58.92 19.32,57.42 IC12.1 18.63,57.42 19,57.05 19,56.05 D40.A
  Bottom 0.406: R49.1 100.75,9.35 103.65,12.25 103.65,23.35 104.15,23.85 v105.2,23.85
  Bottom 0.61: D14.A 125.31,55.68 C19.1 | D23.A 110.07,55.68 C22.1 | D24.A 94.83,55.68 C25.1 | D25.A 79.59,55.68 C28.1 | D39.A 33.87,55.68 C3.1 | D40.A 18.63,55.68 C4.1 | D38.A 49.11,55.68 C2.1 | D37.A 64.35,55.68 C1.1
  Bottom 0.813: 110.05,53.32 C22.1 110.1,53.31 v110.1,52.2 | v18.6,51.45 18.6,53.31 C4.1 | C3.1 v33.87,52.32 | C2.1 v49.11,52.36 | C1.1 v64.35,52.25 | C28.1 v79.59,52.26 | C25.1 v94.83,52.32 | C19.1 125.31,51.76 124.75,51.2 v120.6,51.2 | v114.8,50 v114.8,31.05
  pour Top (no thermals): 106.3,23.2 118.3,23.2 118.3,25.85 116.55,27.6 116.55,30.8 115.4,31.95 112.05,31.95 112.05,27.7 111.55,27.2 106.35,27.2 105.8,26.65 105.8,23.2
AIR0
  Top 0.254: R53.2 19.05,28.35 18.44,27.74 U$31.23
AIR1
  Top 0.254: R54.2 16.51,28.79 17.64,27.66 U$31.24
AIR2
  Top 0.254: R55.2 13.97,24.78 14.82,23.93 U$31.25
AIR3
  Top 0.254: U$31.26 14.52,23.13 13.25,24.4 13.25,26.85 12.85,27.25 11.95,27.25 11.43,27.77 R56.2
CANH
  Top 0.254: CN3.3 CN2.3
  Bottom 0.254: U$32.7 51.78,14.96 52.24,14.51 R75.1 53.36,14.51 CN3.3
CANL
  Top 0.254: CN3.2 CN2.2
  Bottom 0.254: CN3.2 54.2,13.76 54.2,15.35 53.95,15.6 53.4,15.6 53.05,15.95 U$32.6 53.05,19.41 54.44,20.79 JP1.1
CS  (via drill 0.31)
  Top 0.254: v30.25,19.05 27.65,19.05 26.93,18.33 U$31.9
  Bottom 0.254: IC24.16 v30.25,19.05
GND  (via drill 0.31)
  other vias: 18.5,22 19.5,21 19.45,13.5 15.8,12.85 21.55,8.05 21.65,30.1 34.4,24.05 44.4,17.55 47.35,9.35 47.35,19 3.4,18.3 3.4,16.8 3.4,15.3 3.4,13.8 7.4,34.3 8.4,34.3 16.4,34.3 17.4,34.3 25.4,34.3 26.4,34.3 34.4,34.3 35.4,34.3 52.6,29.3 53.6,29.3 57.7,29.3 58.7,29.3 62.9,29.3 63.9,29.3 67.9,29.3 68.9,29.3 72.9,29.3 73.9,29.3 78,29.3 79,29.3 83,29.3 84,29.3 88.5,29.3 89.5,29.3 100.9,39.5 100.9,38.1 100.9,21.1 100.9,19.6 100.9,18.1 100.9,16.6 66.4,2.55 67.9,2.55 15.7,17.1 16.5,17.1 22.55,8.05 23.55,8.05 24.55,8.05 25.55,8.05
  pour Top (no thermals): -0.85,41.35 101.3,41.35 101.95,40.7 101.95,13.25 99.05,10.35 99.05,-0.15 -0.2,-0.15 -0.85,-0.15
  pour Bottom (no thermals): -0.85,41.35 101.3,41.35 101.95,40.7 101.95,13.25 99.05,10.35 99.05,-0.15 -0.85,-0.15
GND2  (via drill 0.31)
  other vias: 3.81,53.34 7.62,53.34 11.43,53.34 15.24,53.34 123,27.5 123,28.5 123,29.5 123,30.5 87,46 93.34,46 80.64,46 74.3,46 67.94,46 61.59,46 55.24,46 48.9,46 36.2,46 27.3,46 18.41,46 9.53,46 47.9,46 54.24,46 60.59,46 66.94,46 73.3,46 79.64,46 86,46 92.34,46 107.84,46 108.84,46 109.84,46 105.84,34 105.84,32.5 109,1.5 110,1.5 35.2,46 26.3,46 17.41,46 8.53,46 7.62,54.34 11.43,54.34 3.81,54.34 15.24,54.34
  pour Top (no thermals): 16.25,67.95 135.35,67.95 135.35,15.4 131.65,11.7 131.65,3.85 122.55,3.85 122.55,16.1 124.58,18.13 124.58,47.55 122.43,49.7 16.5,49.7 16.25,49.95
  pour Top (rank 6, no thermals): 123.85,3.85 120.55,3.85 117.95,6.45 109.4,6.45 109.4,4.6 112.2,4.6 112.55,4.25 112.55,-0.15 99.8,-0.15 99.8,10.05 102.65,12.9 102.65,41.05 101.65,42.05 -0.15,42.05 -0.15,55.35 15.55,55.35 15.55,49.6 16.1,49.05 122,49.05 123.85,47.2
  pour Bottom (rank 6, no thermals): 131.65,10.75 131.65,-0.15 126.95,-0.15 99.8,-0.15 99.8,10.05 102.65,12.9 102.65,15.15 102.65,41.05 101.75,41.95 101.65,42.05 100.15,42.05 -0.2,42.05 -0.2,49.5 -0.2,55.35 15.55,55.35 16.25,55.35 16.25,56.85 16.25,67.95 16.95,67.95 135.35,67.95 135.35,64.3 135.35,15.75 135.35,15.4 131.65,11.7
INT  (via drill 0.31)
  Top 0.254: U$31.32 v17.55,18.33 | v30.12,13.97 v28.68,13.97
  Bottom 0.254: IC24.12 v30.12,13.97 | v28.68,13.97 26.5,16.15 26.5,17.65 25.82,18.33 v17.55,18.33
MISO  (via drill 0.31)
  Top 0.254: v26.4,23.9 24.76,23.9 arc-90 U$31.16
  Bottom 0.254: U$30.2 41.87,6.93 41.25,7.55 36.1,7.55 35.55,8.1 35.55,16.8 34.57,17.78 IC24.15 29.77,17.78 29.3,18.25 29.3,23.35 28.75,23.9 v26.4,23.9
MOSI  (via drill 0.31)
  Top 0.254: v27.15,23.1 24.76,23.1 U$31.15
  Bottom 0.254: U$30.3 39.37,6.13 38.6,6.9 35.75,6.9 35.05,7.6 35.05,15.55 34.09,16.51 IC24.14 29.69,16.51 28.75,17.45 28.75,22.7 28.35,23.1 v27.15,23.1
N$1  (via drill 0.8)
  Bottom 0.254: IC11.4 34.27,58.92 34.6,59.25 34.6,63.75 34,64.35 C11.2
  Bottom 0.813: v34.05,70.75 33.02,69.72 C11.2
  other vias: 32.15,74.56 34.05,74.56 35.96,74.56 37.87,74.56 39.77,74.56 41.67,74.56 34.05,72.66 32.15,72.66 35.96,72.66 37.87,72.66 39.77,72.66 41.67,72.66 32.15,70.75 35.96,70.75 37.87,70.75 39.77,70.75 41.67,70.75
  pour Top (no thermals): 29.85,77.05 44.15,77.05 44.15,68.85 29.85,68.85
  pour Bottom (no thermals): 44.15,78.1 44.15,100.25 42.3,100.25 29.85,100.25 29.85,74.85 29.85,68.85 36.85,68.85 44.15,68.85
N$2  (via drill 0.31)
  Top 0.254: v43.55,76.25 42.58,76.25 U$11.4
  Bottom 0.254: R1.2 43.38,64.55 | 43.38,64.55 D33.A | 43.38,64.55 43.38,65.53 44.05,66.2 44.05,75.75 v43.55,76.25
N$3
  Top 0.254: R3.1 Q1.C
N$4  (via drill 0.31)
  Top 0.254: v42.55,66.15 U$12.4
  Bottom 0.254: R2.2 38.3,64.55 D34.A 40.64,65.44 40.95,65.75 42.15,65.75 v42.55,66.15
N$5  (via drill 0.31)
  Top 0.254: v27.3,66.05 U$5.4
  Bottom 0.254: R8.2 23.06,64.55 D36.A 25.4,65.35 25.75,65.7 26.95,65.7 v27.3,66.05
N$6  (via drill 0.31)
  Top 0.254: v28.1,76.3 27.32,76.3 arc90 U$17.4
  Bottom 0.254: R7.2 28.14,64.55 | 28.14,64.55 D35.A | 28.14,64.55 28.14,65.44 28.75,66.05 28.75,76.05 28.5,76.3 v28.1,76.3
N$7
  Bottom 0.254: D33.K 43.38,62.45 R1.1 42.33,63.5 36.5,63.5 35.85,62.85 35.85,59.8 34.47,58.42 IC11.3
N$8
  Bottom 0.254: R2.1 38.3,62.45 D34.K 40.64,57.79 40.27,57.42 IC11.10
N$9
  Bottom 0.254: D35.K 28.14,62.45 R7.1 27.09,63.5 21.25,63.5 20.6,62.85 20.6,59.85 19.17,58.42 IC12.3
N$10
  Bottom 0.254: IC12.10 24.87,57.42 25.4,57.95 D36.K 23.06,62.45 R8.1
N$11
  Bottom 0.254: IC12.6 23.58,59.42 24.13,58.87 R12.2
N$12  (via drill 0.31)
  Top 0.254: IC5.5 90.17,47.57 90.75,48.15 v122.4,48.15
  Bottom 0.254: v122.4,48.15 126.25,48.15 127.05,48.95 127.05,57.3 128.17,58.42 IC15.8
N$13  (via drill 0.31)
  Top 0.254: IC6.5 83.82,48.17 84.45,48.8 110.85,48.8 v111.85,49.8
  Bottom 0.254: v111.85,49.8 111.85,57.5 112.77,58.42 IC16.8
N$14
  Bottom 0.305: D39.K 31.97,57.57 32.23,57.83 | 32.23,57.83 32.32,57.92 IC11.2 | C11.1 32.23,61.85 32.23,57.83
N$15
  Bottom 0.305: D40.K 16.73,57.53 17.12,57.92 | 17.12,57.92 IC12.2 | C12.1 17.12,61.99 17.12,57.92
N$16  (via drill 0.31)
  Top 0.254: IC7.5 77.47,48.87 77.95,49.35 95.95,49.35 v96.6,50
  Bottom 0.254: v96.6,50 96.6,57.4 97.62,58.42 IC19.8
N$17  (via drill 0.8)
  Bottom 0.254: IC12.4 18.92,58.92 19.45,59.45 19.45,63.7 18.8,64.35 C12.2
  Bottom 0.813: v18.82,70.75 17.78,69.72 C12.2
  other vias: 16.91,74.56 18.82,74.56 20.72,74.56 22.62,74.56 24.53,74.56 26.43,74.56 16.91,72.66 18.82,72.66 20.72,72.66 22.62,72.66 24.53,72.66 26.43,72.66 16.91,70.75 20.72,70.75 22.62,70.75 24.53,70.75 26.43,70.75
  pour Bottom (no thermals): 28.85,68.85 28.85,100.3 16.25,100.3 16.25,68.85
  pour Top (no thermals): 16.25,68.85 16.25,76.7 16.6,77.05 28.85,77.05 28.85,68.85
N$18
  Bottom 0.254: IC11.6 38.83,59.42 39.37,58.88 R9.2
N$19  (via drill 0.31)
  Top 0.254: IC8.5 71.12,48.82 72.45,50.15 v80.25,50.15
  Bottom 0.254: v80.25,50.15 81.3,51.2 81.3,57.55 82.17,58.42 IC20.8
N$20  (via drill 0.8)
  Bottom 0.254: IC9.4 64.77,58.92 65.1,59.25 65.1,63.65 64.4,64.35 C9.2
  Bottom 0.813: v64.53,70.75 63.5,69.72 C9.2
  other vias: 62.63,74.56 64.53,74.56 66.44,74.56 68.34,74.56 70.25,74.56 72.16,74.56 62.63,72.66 62.63,70.75 64.53,72.66 66.44,72.66 66.44,70.75 68.34,70.75 68.34,72.66 70.25,72.66 70.25,70.75 72.16,70.75 72.16,72.66
  pour Top (no thermals): 60.3,77.05 74.55,77.05 74.55,68.85 60.3,68.85
  pour Bottom (no thermals): 74.55,76.85 74.55,86.75 71.9,89.4 71,90.3 71,91.95 71,100.15 68.75,100.15 60.3,100.15 60.3,77.35 60.3,68.85 74.55,68.85
N$21  (via drill 0.31)
  Top 0.254: v74,76.3 73.05,76.3 U$6.4
  Bottom 0.254: D29.A 76,64.35 R13.2 73.66,65.21 74.4,65.95 74.4,75.9 v74,76.3
N$22  (via drill 0.31)
  Top 0.254: v73,66.1 73,67.3 U$7.4
  Bottom 0.254: R14.2 70.92,64.35 D30.A 71.12,65.47 71.45,65.8 72.7,65.8 v73,66.1
N$23  (via drill 0.31)
  Top 0.254: v57.8,66 57.8,67.31 U$10.4
  Bottom 0.254: R16.2 53.54,64.55 D32.A 55.88,65.43 56.1,65.65 57.45,65.65 v57.8,66
N$24  (via drill 0.31)
  Top 0.254: v58.65,76.25 57.81,76.25 U$9.4
  Bottom 0.254: R15.2 58.62,64.55 | 58.62,64.55 D31.A | 58.62,64.55 58.62,65.42 59.35,66.15 59.35,75.9 59,76.25 v58.65,76.25
N$25
  Bottom 0.254: D29.K 76,62.65 R13.1 72.81,63.5 66.8,63.5 66.35,63.05 66.35,59.8 64.97,58.42 IC9.3
N$26
  Bottom 0.254: R14.1 70.92,62.65 D30.K 71.12,57.97 70.57,57.42 IC9.10
N$27
  Bottom 0.254: D31.K 58.62,62.45 R15.1 57.57,63.5 51.65,63.5 51.05,62.9 51.05,59.8 49.67,58.42 IC10.3
N$28
  Bottom 0.254: IC10.10 55.27,57.42 55.88,58.03 D32.K 53.54,62.45 R16.1
N$29
  Bottom 0.254: IC10.6 54.13,59.42 54.61,58.94 R32.2
N$30
  Bottom 0.305: D37.K 62.45,57.5 62.87,57.92 63,57.92 | 63,57.92 IC9.2 | C9.1 63,62.15 63,57.92
N$31
  Bottom 0.305: D38.K 47.21,57.56 47.57,57.92 | 47.57,57.92 IC10.2 | C10.1 47.57,61.96 47.57,57.92
N$32
  Bottom 0.254: IC9.6 69.33,59.42 69.85,58.9 R17.2
N$33  (via drill 0.8)
  Bottom 0.254: IC10.4 49.42,58.92 49.95,59.45 49.95,63.65 49.25,64.35 C10.2
  Bottom 0.813: v49.3,70.75 48.26,69.72 C10.2
  other vias: 47.39,74.56 49.3,74.56 51.2,74.56 53.1,74.56 55.01,74.56 56.91,74.56 56.91,72.66 55.01,72.66 53.1,72.66 51.2,72.66 49.3,72.66 47.39,72.66 47.39,70.75 51.2,70.75 53.1,70.75 55.01,70.75 56.91,70.75
  pour Top (no thermals): 45.05,77.05 59.45,77.05 59.45,68.85 45.05,68.85
  pour Bottom (no thermals): 59.45,74.6 59.45,100.3 55.45,100.3 45.05,100.3 45.05,75.05 45.05,68.85 52.2,68.85 59.45,68.85
N$34  (via drill 0.31)
  Top 0.254: IC1.5 64.77,48.82 v65.3,49.35
  Bottom 0.254: v65.3,49.35 66.1,50.15 66.1,57.6 66.92,58.42 IC9.8
N$35  (via drill 0.31)
  Top 0.254: IC2.5 58.42,49.28 58.05,49.65 52.75,49.65 v52.3,50.1
  Bottom 0.254: v52.3,50.1 51.1,51.3 51.1,57.7 51.82,58.42 IC10.8
N$36  (via drill 0.31)
  Top 0.254: IC3.5 52.07,49.23 51.5,49.8 36.25,49.8 v35.9,50.15
  Bottom 0.254: v35.9,50.15 35.9,57.7 36.62,58.42 IC11.8
N$37  (via drill 0.31)
  Top 0.254: IC4.5 45.72,48.58 45.05,49.25 21.2,49.25 v20.75,49.7
  Bottom 0.254: v20.75,49.7 20.75,57.85 21.32,58.42 IC12.8
N$38
  Top 0.254: R33.1 Q5.C
N$39
  Top 0.254: IC1.3 R33.2
N$40
  Top 0.254: IC2.3 59.75,38.78 59.75,37.4 60.96,36.19 R34.2
N$41
  Top 0.254: R34.1 Q6.C
N$42
  Top 0.254: IC3.3 53.35,38.83 53.35,37.45 53.85,36.95 55.1,36.95 55.88,36.17 R39.2
N$43
  Top 0.254: R39.1 Q7.C
N$44  (via drill 0.8)
  Bottom 0.254: IC19.4 95.32,58.92 95.7,59.3 95.7,63.75 95.1,64.35 C26.2
  Bottom 0.813: v95.02,70.75 93.98,69.72 C26.2
  other vias: 93.11,74.56 95.02,74.56 96.92,74.56 98.83,74.56 100.73,74.56 102.64,74.56 102.64,72.66 102.64,70.75 100.73,70.75 100.73,72.66 98.83,72.66 98.83,70.75 96.92,70.75 96.92,72.66 95.02,72.66 93.11,70.75 93.11,72.66
  pour Top (no thermals): 90.8,77.05 105.15,77.05 105.15,68.85 90.8,68.85
  pour Bottom (no thermals): 105.15,68.85 105.15,100.2 102.95,100.2 90.8,100.2 90.8,74.5 90.8,68.85
N$45
  Top 0.254: IC4.3 47,38.83 47,37.55 47.75,36.8 50.15,36.8 50.8,36.15 R40.2
N$46  (via drill 0.31)
  Top 0.254: v104.6,76.25 103.53,76.25 U$23.4
  Bottom 0.254: R19.2 104.34,64.55 | 104.34,64.55 D19.A | 104.34,64.55 104.34,65.59 105.1,66.35 105.1,75.75 v104.6,76.25
N$47  (via drill 0.31)
  Top 0.254: U$24.4 v103.5,66.16
  Bottom 0.254: R20.2 101.4,64.35 D20.A 101.6,65.4 102,65.8 103.15,65.8 v103.5,66.16
N$48  (via drill 0.31)
  Top 0.254: v88.25,65.95 88.25,67.31 U$8.4
  Bottom 0.254: R22.2 86.16,64.35 D22.A 86.36,65.46 86.55,65.65 87.95,65.65 v88.25,65.95
N$49  (via drill 0.31)
  Top 0.254: v89.3,76.3 88.28,76.3 U$25.4
  Bottom 0.254: R21.2 89.1,64.55 | 89.1,64.55 D21.A | 89.1,64.55 89.1,65.6 89.7,66.2 89.7,75.9 v89.3,76.3
N$50
  Bottom 0.254: D19.K 104.34,62.45 R19.1 103.24,63.55 97.65,63.55 96.95,62.85 96.95,59.85 95.52,58.42 IC19.3
N$51
  Bottom 0.254: R20.1 101.4,62.65 D20.K 101.6,57.8 101.22,57.42 IC19.10
N$52
  Bottom 0.254: D21.K 89.1,62.45 R21.1 88.05,63.5 82.15,63.5 81.5,62.85 81.5,59.7 80.22,58.42 IC20.3
N$53
  Bottom 0.254: R22.1 86.16,62.65 D22.K 86.4,62.41 86.4,57.7 86.12,57.42 IC20.10
N$54
  Top 0.254: R40.1 Q8.C
N$55
  Bottom 0.254: IC20.6 84.48,59.42 85.09,58.81 R24.2
N$56  (via drill 0.31)
  Top 0.254: R45.2 v76.2,22.25 76.2,22.85 71.7,27.35 65.8,27.35 65.09,28.06 Q5.B
  Bottom 0.254: v76.2,22.25 R45.2
N$57
  Bottom 0.305: D24.K 92.93,57.58 93.27,57.92 | 93.27,57.92 IC19.2 | C26.1 93.27,61.94 93.27,57.92
N$58
  Bottom 0.305: D25.K 77.69,57.59 78.02,57.92 | 78.02,57.92 IC20.2 | C29.1 78.02,61.93 78.02,57.92
N$59  (via drill 0.8)
  Bottom 0.254: IC20.4 80.02,58.92 80.45,59.35 80.45,63.45 79.55,64.35 C29.2
  Bottom 0.813: v79.78,70.75 78.74,69.72 C29.2
  other vias: 77.87,74.56 79.78,74.56 81.68,74.56 83.58,74.56 85.49,74.56 87.39,74.56 87.39,72.66 87.39,70.75 85.49,70.75 85.49,72.66 83.58,72.66 83.58,70.75 81.68,70.75 81.68,72.66 79.78,72.66 77.87,72.66 77.87,70.75
  pour Top (no thermals): 75.4,77.05 89.85,77.05 89.85,68.85 75.4,68.85
  pour Bottom (no thermals): 89.85,74.4 89.85,100.15 87.15,100.15 79,100.15 79,90.45 75.4,86.85 75.4,74.3 75.4,68.85 89.85,68.85
N$60  (via drill 0.31)
  Top 0.254: R46.2 v73.65,22.2 73.65,22.9 69.9,26.65 61.1,26.65 60.01,27.74 Q6.B
  Bottom 0.254: v73.65,22.2 R46.2
N$61
  Bottom 0.254: IC19.6 99.63,59.42 100.33,58.72 R23.2
N$62  (via drill 0.8)
  Bottom 0.254: C20.2 125.45,64.35 126.2,63.6 126.2,59.25 125.87,58.92 IC15.4
  Bottom 0.813: C20.2 124.46,69.85
  other vias: 123.59,74.56 123.59,72.66 123.19,70.75 125.5,70.75 125.5,72.66 125.5,74.56 127.4,74.56 129.31,74.56 131.21,74.56 133.12,74.56 133.12,72.66 133.12,70.75 131.21,70.75 131.21,72.66 129.31,72.66 129.31,70.75 127.4,70.75 127.4,72.66
  pour Top (no thermals): 121.25,77.05 134.4,77.05 135.35,76.1 135.35,68.85 121.25,68.85
  pour Bottom (no thermals): 135.35,68.85 135.35,100.1 121.25,100.1 121.25,68.85
N$63  (via drill 0.8)
  Bottom 0.254: C23.2 110.3,64.35 110.95,63.7 110.95,59.4 110.47,58.92 IC16.4
  Bottom 0.813: v110.25,70.75 109.22,69.72 C23.2
  other vias: 108.35,74.56 110.25,74.56 112.16,74.56 114.06,74.56 115.97,74.56 117.88,74.56 117.88,72.66 117.88,70.75 115.97,70.75 114.06,70.75 112.16,70.75 108.35,70.75 108.35,72.66 110.25,72.66 112.16,72.66 114.06,72.66 115.97,72.66
  pour Top (no thermals): 105.85,77.05 120.5,77.05 120.5,68.85 105.85,68.85
  pour Bottom (no thermals): 120.5,76.25 120.5,100.15 108.4,100.15 105.85,100.15 105.85,74.4 105.85,68.85 120.5,68.85
N$64  (via drill 0.31)
  Top 0.254: U$19.4 134,76.3 v134.95,76.3
  Bottom 0.254: D15.A 136.96,64.35 R26.2 134.62,65.22 135.7,66.3 135.7,75.55 v134.95,76.3
N$65  (via drill 0.31)
  Top 0.254: v134,65.95 134,67.31 U$20.4
  Bottom 0.254: R27.2 131.88,64.35 D16.A 132.08,65.33 132.35,65.6 133.65,65.6 v134,65.95
N$66  (via drill 0.31)
  Top 0.254: v118.75,66.1 U$22.4
  Bottom 0.254: R29.2 116.64,64.35 D18.A 116.84,65.59 117.15,65.9 118.55,65.9 v118.75,66.1
N$67  (via drill 0.31)
  Top 0.254: v119.65,76.25 118.78,76.25 U$21.4
  Bottom 0.254: D17.A 121.72,64.35 R28.2 119.38,65.33 120.4,66.35 120.4,75.5 v119.65,76.25
N$68
  Bottom 0.254: D15.K 136.96,62.65 R26.1 133.77,63.5 127.9,63.5 127.15,62.75 127.15,59.25 126.32,58.42 IC15.3
N$69
  Bottom 0.254: R27.1 131.88,62.65 D16.K 132.08,57.78 131.72,57.42 IC15.10
N$70
  Bottom 0.254: D17.K 121.72,62.65 R28.1 118.53,63.5 112.85,63.5 112.15,62.8 112.15,59.6 110.97,58.42 IC16.3
N$71
  Bottom 0.254: IC16.10 116.37,57.42 116.84,57.89 D18.K 116.64,62.65 R29.1
N$72  (via drill 0.31)
  Top 0.254: R47.2 71.1,21.19 v71.1,22.3 71.1,22.95 68.05,26 56.2,26 54.93,27.27 Q7.B
  Bottom 0.254: v71.1,22.3 71.1,21.17 R47.2
N$73
  Bottom 0.254: IC16.6 115.03,59.42 115.57,58.88 R31.2
N$74  (via drill 0.31)
  Top 0.254: R48.2 68.6,21.19 v68.6,22.25 68.6,22.8 66.1,25.3 51.65,25.3 49.85,27.1 Q8.B
  Bottom 0.254: v68.6,22.25 68.6,21.17 R48.2
N$75
  Bottom 0.305: 124.18,57.92 IC15.2 123.85,57.92 | D14.K 123.41,57.61 123.72,57.92 123.85,57.92 | C20.1 123.85,62.04 123.85,57.92
N$76
  Bottom 0.305: D23.K 108.17,57.62 108.47,57.92 | 108.47,57.92 IC16.2 | C23.1 108.47,61.9 108.47,57.92
N$77  (via drill 0.31)
  Top 0.254: v103.42,3.08 IC13.4
  Bottom 0.254: R49.2 R50.1 v103.42,3.08
N$78
  Top 0.813: U$26.A 11.7,19.39 R51.1
N$79
  Bottom 0.254: IC15.6 130.33,59.42 130.81,58.94 R30.2
N$80
  Top 0.254: IC5.3 91.45,38.83 91.45,37.45 90.85,36.85 87,36.85 86.36,36.21 R3.2
N$81
  Top 0.254: IC6.3 85.09,37.44 84.9,37.25 82.1,37.25 81.28,36.43 R4.2
N$82
  Top 0.254: R4.1 Q2.C
N$83  (via drill 0.31)
  other vias: 108.4,11.35 109.9,11.35 111.4,11.35
  pour Top (no thermals): 112.6,6.45 106.4,6.45 106.4,14.8 105.9,15.3 105.9,18.25 105.9,18.45 109.9,18.45 112.6,18.45
  pour Bottom (no thermals): 106.4,6.45 112.6,6.45 112.6,12.3 106.4,12.3
N$84
  Top 0.254: IC7.3 78.74,37.64 78.2,37.1 76.85,37.1 76.2,36.45 R5.2
N$85
  Top 0.61: R52.1 U$27.A
N$86
  Top 0.61: IC13.1 105.06,6.89 C14.1
N$87  (via drill 0.31)
  Top 0.254: R57.1 v19.05,32.15 19.45,32.55 30.4,32.55 30.8,32.95 Q9.B
  Bottom 0.254: v19.05,32.15 R57.1
N$88  (via drill 0.31)
  Top 0.254: R58.1 v16.5,32.2 17.35,33.05 21.4,33.05 21.91,33.56 Q10.B
  Bottom 0.254: v16.5,32.2 R58.1
N$89  (via drill 0.31)
  Top 0.254: R59.1 14,31.36 v14,32.2 13.02,33.18 Q11.B
  Bottom 0.254: v14,32.2 14,31.33 R59.1
N$90  (via drill 0.31)
  Top 0.254: R60.1 11.45,31.33 v11.45,32.2 10.7,32.95 4.45,32.95 4.13,33.27 Q12.B
  Bottom 0.254: R60.1 11.45,31.35 v11.45,32.2
N$91  (via drill 0.31)
  Top 0.254: IC17.1 Q9.C
  Top 0.406: v30.73,38.52 31.43,38.52 IC17.1
  Bottom 0.406: R61.1 v30.73,38.52
N$92
  Top 0.254: R62.2 13.97,48.93 14.45,48.45 31.8,48.45 33.02,47.23 IC17.5
N$93
  Top 0.254: R5.1 Q3.C
N$94
  Top 0.254: IC8.3 72.39,37.29 71.12,36.02 R6.2
N$95  (via drill 0.31)
  Top 0.254: R63.1 v13.97,52.73 13.97,53.73 Q13.B
  Bottom 0.254: R63.1 v13.97,52.73
N$96  (via drill 0.31)
  other vias: 13.34,60.33 13.34,59.05 14.61,59.05 14.61,60.33
  pour Top (no thermals): 15.5,62.75 12.35,62.75 12.35,56.2 15.5,56.2
  pour Bottom (no thermals): 12.35,56.2 12.35,65.6 7.45,70.5 7.45,80.6 7.9,81.05 11.75,81.05 12.3,80.5 12.3,79.5 11.7,78.9 9.5,78.9 9.1,78.5 9.1,72.2 15.5,65.8 15.5,56.2
N$97
  Top 0.254: R65.2 10.16,48.39 10.65,47.9 23.05,47.9 24.13,46.82 IC21.5
N$98
  Top 0.254: R68.2 6.35,48.3 7.4,47.25 14.6,47.25 15.24,46.61 IC22.5
N$99
  Top 0.254: R71.2 2.54,48.11 3.15,47.5 5.75,47.5 6.35,46.9 IC23.5
N$100  (via drill 0.31)
  Top 0.254: IC21.1 Q10.C
  Top 0.406: v21.88,38.52 22.54,38.52 IC21.1
  Bottom 0.406: R64.1 v21.88,38.52
N$101  (via drill 0.31)
  Top 0.254: R66.1 v10.16,52.75 10.16,53.73 Q14.B
  Bottom 0.254: v10.16,52.75 R66.1
N$102  (via drill 0.31)
  other vias: 9.53,60.33 9.53,59.05 10.79,59.05 10.79,60.33
  pour Top (no thermals): 8.75,62.75 8.55,62.75 8.55,61.75 8.55,56.2 8.8,56.2 11.8,56.2 11.8,62.4 11.8,62.75
  pour Bottom (no thermals): 8.55,56.2 8.55,65.65 5.3,68.9 5.3,83.05 5.75,83.5 11.7,83.5 12.3,82.9 12.3,82.15 11.65,81.5 7.5,81.5 6.9,80.9 6.9,70.1 11.8,65.2 11.8,56.2
N$103
  Top 0.254: R6.1 Q4.C
N$104  (via drill 0.31)
  Top 0.254: IC22.1 Q11.C
  Top 0.406: v13.08,38.52 13.65,38.52 IC22.1
  Bottom 0.406: R67.1 v13.08,38.52
N$105  (via drill 0.31)
  Top 0.254: R69.1 v6.35,52.75 6.35,53.73 Q15.B
  Bottom 0.254: R69.1 v6.35,52.75
N$106  (via drill 0.31)
  other vias: 5.71,60.33 5.71,59.05 6.99,59.05 6.99,60.33
  pour Top (no thermals): 4.7,62.75 4.7,56.25 4.7,56.2 7.05,56.2 8,56.2 8,62.5 8,62.75
  pour Bottom (no thermals): 4.7,56.2 4.7,65.65 3.1,67.25 3.1,85.45 3.7,86.05 11.85,86.05 12.3,85.6 12.3,84.6 11.8,84.1 5.65,84.1 4.75,83.2 4.75,68.55 8,65.3 8,56.2
N$107  (via drill 0.31)
  Top 0.254: IC23.1 Q12.C
  Top 0.406: v4.18,38.52 4.76,38.52 IC23.1
  Bottom 0.406: R70.1 v4.18,38.52
N$108  (via drill 0.31)
  other vias: 1.91,60.33 3.17,60.33 1.91,59.05 3.17,59.05
  pour Top (no thermals): -0.1,62.75 4.15,62.75 4.15,56.2 -0.1,56.2
  pour Bottom (no thermals): 4.15,56.2 4.15,65.25 2.45,66.95 2.45,85.8 3.3,86.75 11.8,86.65 12.3,87.15 12.3,88.1 11.65,88.75 0.45,88.75 -0.15,88.15 -0.15,56.2
N$109  (via drill 0.31)
  Top 0.254: R72.1 v2.55,52.75 2.55,53.72 Q16.B
  Bottom 0.254: v2.55,52.75 R72.1
N$110
  Top 0.254: C47.2 24.59,13.46 Q17.3 24.57,14.63 23.24,15.96 U$31.8
N$111
  Top 0.254: C48.2 Q17.1 22.49,11.19 23.3,12 23.3,15 22.44,15.86 U$31.7
N$112
  Bottom 0.254: R73.1 U$32.8
N$113
  Bottom 0.254: IC24.8 44.26,12.7 Q18.1 44.8,12.16 C50.2
N$114
  Bottom 0.254: IC24.7 43.18,13.97 43.55,13.6 45.8,13.6 46.92,14.72 Q18.3 46.92,17.27 C51.2
N$115  (via drill 0.31)
  Top 0.254: R35.2 v86.36,22.4 v86.35,22.41 86.35,23 85.41,23.94 Q1.B
  Bottom 0.254: v86.36,22.4 R35.2
N$116  (via drill 0.31)
  Top 0.254: R36.2 83.85,21.2 v83.85,22.3 83.85,22.95 80.33,26.47 Q2.B
  Bottom 0.254: v83.85,22.3 83.85,21.17 R36.2
N$117  (via drill 0.31)
  Top 0.254: R37.2 81.25,21.17 v81.25,22.2 81.25,22.9 75.25,28.9 Q3.B
  Bottom 0.254: v81.25,22.2 81.25,21.2 R37.2
N$118  (via drill 0.31)
  Top 0.254: R38.2 arc-90 78.7,21.21 v78.7,22.2 78.7,22.85 73.45,28.1 70.45,28.1 70.17,28.38 Q4.B
  Bottom 0.254: v78.7,22.2 78.7,21.21 arc90 R38.2
N$121
  Bottom 0.254: JP1.2 56.25,16.95 56.25,15 55.76,14.51 R75.2
N$123  (via drill 3.2 pad 6)
  other vias: 5,95
N$124  (via drill 3.2 pad 6)
  other vias: 75,95
N$125  (via drill 3.2 pad 6)
  other vias: 145,95
N$126  (via drill 3.2 pad 6)
  other vias: 5,5
N$127  (via drill 3.2 pad 6)
  other vias: 75,5
N$128  (via drill 3.2 pad 6)
  other vias: 145,5
PA2_TIM2_CH3
  Top 0.254: R18.1 83,17.75 87.5,17.75 90.17,15.08 JP7.5
PA3_TIM2_CH4
  Top 0.254: R25.1 81.16,17.05 86.7,17.05 88.95,14.8 88.95,11.9 90.17,10.68 JP7.6
PA15_TIM2_CH1
  Top 0.254: R10.1 88.18,19.47 92.71,14.94 JP7.3
PB3_TIM2_CH2
  Top 0.254: R11.1 84.84,18.45 88,18.45 91.5,14.95 91.5,11.85 92.71,10.64 JP7.4
PD12_TIM4_CH1
  Top 0.254: R43.1 75.94,14.65 83.75,14.65 85.09,13.31 JP7.9
PD13_TIM4_CH2
  Top 0.254: R44.1 74.35,13.7 82.9,13.7 83.75,12.85 83.75,11.75 85.09,10.41 JP7.10
PD14_TIM4_CH3
  Top 0.254: R41.1 79.32,16.35 85.8,16.35 87.63,14.52 JP7.7
PD15_TIM4_CH4
  Top 0.254: R42.1 77.63,15.5 84.75,15.5 86.45,13.8 86.45,11.9 87.63,10.72 JP7.8
RESET  (via drill 0.31)
  Top 0.254: JP11.4 7.55,29.45 8.45,28.55 8.45,23.9 9,23.35 12.5,23.35 15.12,20.73 U$31.29 16.17,20.75 17.2,20.75 v17.6,20.35 | S2.1 63.79,7.55 | 63.79,7.55 S2.2 | v30.27,20.32 26.97,20.32 v26.25,19.6 | v63.05,8.1 63.24,8.1 63.79,7.55
  Bottom 0.254: v30.27,20.32 IC24.17 35.13,20.32 36.2,19.25 36.2,8.65 36.75,8.1 v63.05,8.1 | 26.2,19.55 v26.25,19.6 25.9,19.25 17.85,19.25 | v17.6,20.35 17.6,19.5 17.85,19.25 | R74.1 14.93,19.25 17.85,19.25
RXCAN
  Bottom 0.254: IC24.2 40.23,20.32 40,20.55 40,22.95 41.3,24.25 54,24.25 54.33,23.93 U$32.4
RXD
  Top 0.254: U$31.30 14.77,19.93 12.05,22.65 8.5,22.65 7.8,23.35 7.8,26.2 7.09,26.91 JP11.3
SCK  (via drill 0.31)
  Top 0.254: v27.95,21.95 27.95,24.2 27.3,24.85 23.5,24.85 23.24,25.11 U$31.17
  Bottom 0.254: U$30.4 36.87,6.13 36.65,6.35 35.45,6.35 34.55,7.25 34.55,14.2 33.51,15.24 IC24.13 29.61,15.24 27.95,16.9 v27.95,21.95
SS  (via drill 0.31)
  Top 0.254: U$31.14 26.57,22.33 v26.9,22
  Bottom 0.254: v26.9,22 27.15,21.75 27.15,16.8 29.4,14.55 29.4,10.8 29.95,10.25 33.2,10.25 33.75,9.7 33.75,6.8 34.37,6.18 U$30.5
TXCAN
  Bottom 0.254: U$32.1 49.51,23.6 42.4,23.6 41.73,22.93 IC24.1
TXD
  Top 0.254: U$31.31 14.37,19.13 11.67,21.83 JP11.1
V+
  pour Top (no thermals): 16.05,77.9 134.6,77.9 136.15,76.35 136.15,15.05 132.45,11.35 132.45,4.85 150.15,4.85 150.15,91 -0.25,91 -0.25,63.7 15.5,63.7 15.5,77.35
  pour Top (no thermals): 109.9,5.95 117.45,5.95 120.25,3.15 132.15,3.15 132.45,3.45 132.45,5.5 150.15,5.5 150.15,-0.15 113.05,-0.15 113.05,4.45 112.4,5.1 109.9,5.1
VCC
  Top 1.27: IC25.3 10.85,6.46 10.85,4.75 13.3,2.3 C16.1 23.74,2.3 C53.+ 42.9,2.37 42.97,2.37 | 42.97,2.37 44.37,3.77 U$30.1 | CN3.1 CN2.1 58.36,3.56 57.17,2.37 42.97,2.37

## Text on the board
tPlace: GND | VCC